# Altium schematic sheet IO.SchDoc
size A4; SheetNumber: 1; SheetTotal: 3
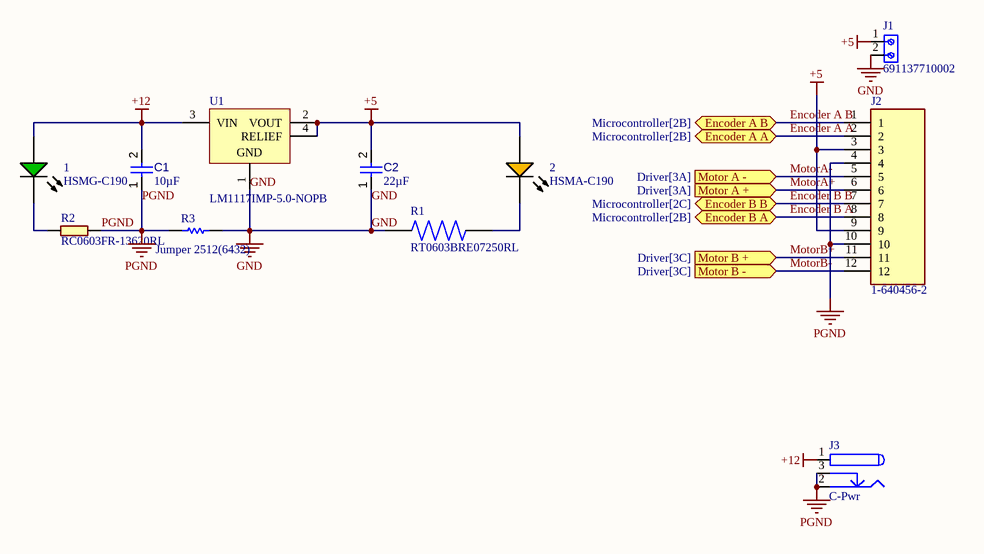
[diagram p0: IO.SchDoc]

## Parts
1  HSMG-C190  [AVAG-HSMX-C190_V]
2  HSMA-C190  [AVAG-HSMX-C190_V]
C1  value 10µF  [CAPC0603(1608)100_L]  (hidden comment: Capacitor 10µF +/-20% 10V 0603)
C2  value 22µF  [CAPC0805(2012)145_L]  (hidden comment: Capacitor 22µF +/-40% 16V 0805)
J1  691137710002  [691137710002]
J2  1-640456-2  [TE_1-640456-2]
J3  C-Pwr  [KLD_XLGE1.2]
R1  RT0603BRE07250RL  [RESC1608X55N]
R2  RC0603FR-13620RL  [0603]
R3  Jumper 2512(6432)  [RESC2512(6432)_L]
U1  LM1117IMP-5.0-NOPB  [DCY0004A_M]

## Ports
Encoder A A (bidir, see Microcontroller[2B]), Encoder A B (bidir, see Microcontroller[2B]), Encoder B A (bidir, see Microcontroller[2B]), Encoder B B (bidir, see Microcontroller[2C]), Motor A + (in, see Driver[3A]), Motor A - (in, see Driver[3A]), Motor B + (in, see Driver[3C]), Motor B - (in, see Driver[3C])

## Nets
+5: 2.1(A) C2.2 J1.1 J2.3 J2.9 U1.2(VOUT) U1.4(RELIEF)
+12: 1.1(A) C1.2 J3.1 U1.3(VIN)
GND: C2.1 J1.2 R1.1 R3.2 U1.1(GND)
PGND: C1.1 J2.4 J2.10 J3.2 J3.3 R2.2 R3.1
Encoder A A: J2.2 ; port Encoder A A
Encoder A B: J2.1 ; port Encoder A B
Encoder B A: J2.8 ; port Encoder B A
Encoder B B: J2.7 ; port Encoder B B
MotorA+: J2.6 ; port Motor A +
MotorA-: J2.5 ; port Motor A -
MotorB+: J2.11 ; port Motor B +
MotorB-: J2.12 ; port Motor B -
Net1_2: 1.2(K) R2.1
Net2_2: 2.2(K) R1.2

## Library data of the parts
1 = CMP-007-00013-2: LED Uni-Color Green, 52 mW, 20 mA, -40 to 85 degC, 2-Pin SMD, RoHS, Tape and Reel; Manufacturer: Avago; Forward Current: 20mA; Viewing Angle: 170degrees; Luminous Intensity: 15mcd; Lens Style: Diffused; Forward Voltage: 2.2V; Power: 52mW; Mounting Technology: SM; RoHS Compliant: True; Packaging: TapeandReel; Illumination Colour: Green; Datasheet URL: http://docs.avagotech.com/docs/AV02-0551EN; Min Operating Temperature: -40°C; Max Operating Temperature: 85°C; Pins: 2; Package Description: 2-Pin Surface Mount Device, Body 1.6 x 0.8 mm, Height 0.9 mm; Nominal Vf: 2.2V; Case/Package: 0603; Manufacturer URL: http://www.avagotech.com/; Datasheet Version: Mar-12; Colour: Green; Package Reference: HSMX-C190; Package Quantity: 4000
2 = CMP-007-00011-2: LED Uni-Color Amber, 60 mW, 20 mA, -40 to 85 degC, 2-Pin SMD, RoHS, Tape and Reel; Manufacturer: Avago; Forward Current: 20mA; Luminous Intensity: 90mcd; Lens Style: Diffused; Power: 60mW; Nominal Vf: 1.9V; Viewing Angle: 170degrees; Illumination Colour: Orange; Datasheet Version: Sep-10; Mounting Technology: SM; Case/Package: 0603; RoHS Compliant: True; Pins: 2; Packaging: TapeandReel; Colour: Orange; Package Reference: HSMX-C190; Manufacturer URL: http://www.avagotech.com/; Package Quantity: 4000; Min Operating Temperature: -40°C; Datasheet URL: http://docs.avagotech.com/docs/AV02-0112EN; Max Operating Temperature: 85°C; Forward Voltage: 1.9V; Package Description: 2-Pin Surface Mount Device, Body 1.6 x 0.8 mm, Height 0.9 mm
C1 = CMP-001-00075-4: Chip Capacitor, 10µF +/-20%, 10V, 0603, Thickness 1 mm; Tolerance: 10%; Voltage Rating: 10V; Max Operating Temperature: 85°C; Pins: 2; Case/Package: 0603; Mounting Technology: SMT; Min Operating Temperature: -55°C
C2 = CMP-001-00081-4: Chip Capacitor, 22µF +/-40%, 16V, 0805, Thickness 1.45 mm; Tolerance: 5%; Voltage Rating: 16V; Mounting Technology: SMT; Pins: 2; Max Operating Temperature: 85°C; Case/Package: 0805; Min Operating Temperature: -55°C
J1 = 691137710002: 2 Position Wire to Board Terminal Block Horizontal with Board 0.197 (5.00mm) Through Hole; MF: WÃ¼rth Elektronik; Price: None; Check_prices: https://www.snapeda.com/parts/691137710002/W%C3%BCrth%20Elektronik/view-part/4793356/?ref=eda; MP: 691137710002; SnapEDA_Link: https://www.snapeda.com/parts/691137710002/W%C3%BCrth%20Elektronik/view-part/4793356/?ref=snap; Package: None; Availability: Warning; Value: *; Purchase-URL: https://pricing.snapeda.com/search/part/691137710002/?ref=eda
J3 = C-Pwr: Low Voltage Power Supply Connector; Published: 17-Dec-2003; DatasheetDocument: 09-May-2002; Publisher: Altium Limited; ComponentLink1Description: Manufacturer Link; ComponentLink1URL: http://domino.kycon.com/internet/Products.html; ComponentLink2URL: http://www.cui.com/product/resource/pj-102a.pdf; ComponentLink2Description: Datasheet (ELEC391)
R1 = RT0603BRE07250RL: 250 Ohms Â±0.1% 0.1W, 1/10W Chip Resistor 0603 (1608 Metric) - Thin Film; MF: Yageo; Value: *; SnapEDA_Link: https://www.snapeda.com/parts/RT0603BRE07250RL/Yageo/view-part/?ref=snap; Purchase-URL: https://pricing.snapeda.com/search/part/RT0603BRE07250RL/?ref=eda; Availability: In Stock; Price: None; Package: 1608 Yageo; Check_prices: https://www.snapeda.com/parts/RT0603BRE07250RL/Yageo/view-part/?ref=eda; MP: RT0603BRE07250RL
R2 = RC0603FR-13620RL: https://octopart.com/rc0603fr-13100kl-yageo-12819546; Package: None; Price: None; Value: *; MP: RC0603FR-13620RL; Availability: Unavailable
R3 = CMP-1018-00001-1: Jumper 2512 (6432 Metric); Tolerance: None; Case-EIA: 2512; Value: 0.00 Ohm; Case-Metric: 6432; Technology: SMT; Power: None
U1 = CMP-019-00021-4: Low-Dropout Linear Regulator, 800 mA, -40 to 125 degC, 4-Pin SOT-223 (DCY), Green (RoHS & no Sb/Br), Tape and Reel; Manufacturer: Texas Instruments; Nominal Output Voltage: 5V; Dropout Voltage: 1.2V; Output Current: 800mA; Min Input Voltage: 2.6V; Max Input Voltage: 15V; Outputs: 1; Datasheet Version: SNOS412N, 01/2016; Case/Package: SOT-223; Min Operating Temperature: -40°C; Mounting Technology: SM; Package Description: 4-Pin Small Outline Transistor, Body 6.5 x 3.5 mm, Pitch 2.3 mm; Max Ouput Current: 800mA; Output Voltage: 5V; Manufacturer URL: http://www.ti.com/; Max Operating Temperature: 125°C; Datasheet URL: http://www.ti.com/lit/ds/symlink/lm1117.pdf; Packaging: TapeandReel; RoHS Compliant: True; Package Reference: DCY0004A; Pins: 4
J2 = 1-640456-2: Package: None; Price: None; Value: *; MP: 1-640456-2; Availability: Unavailable